# EAGLE design gesture_calculator (EAGLE 9.6.2)
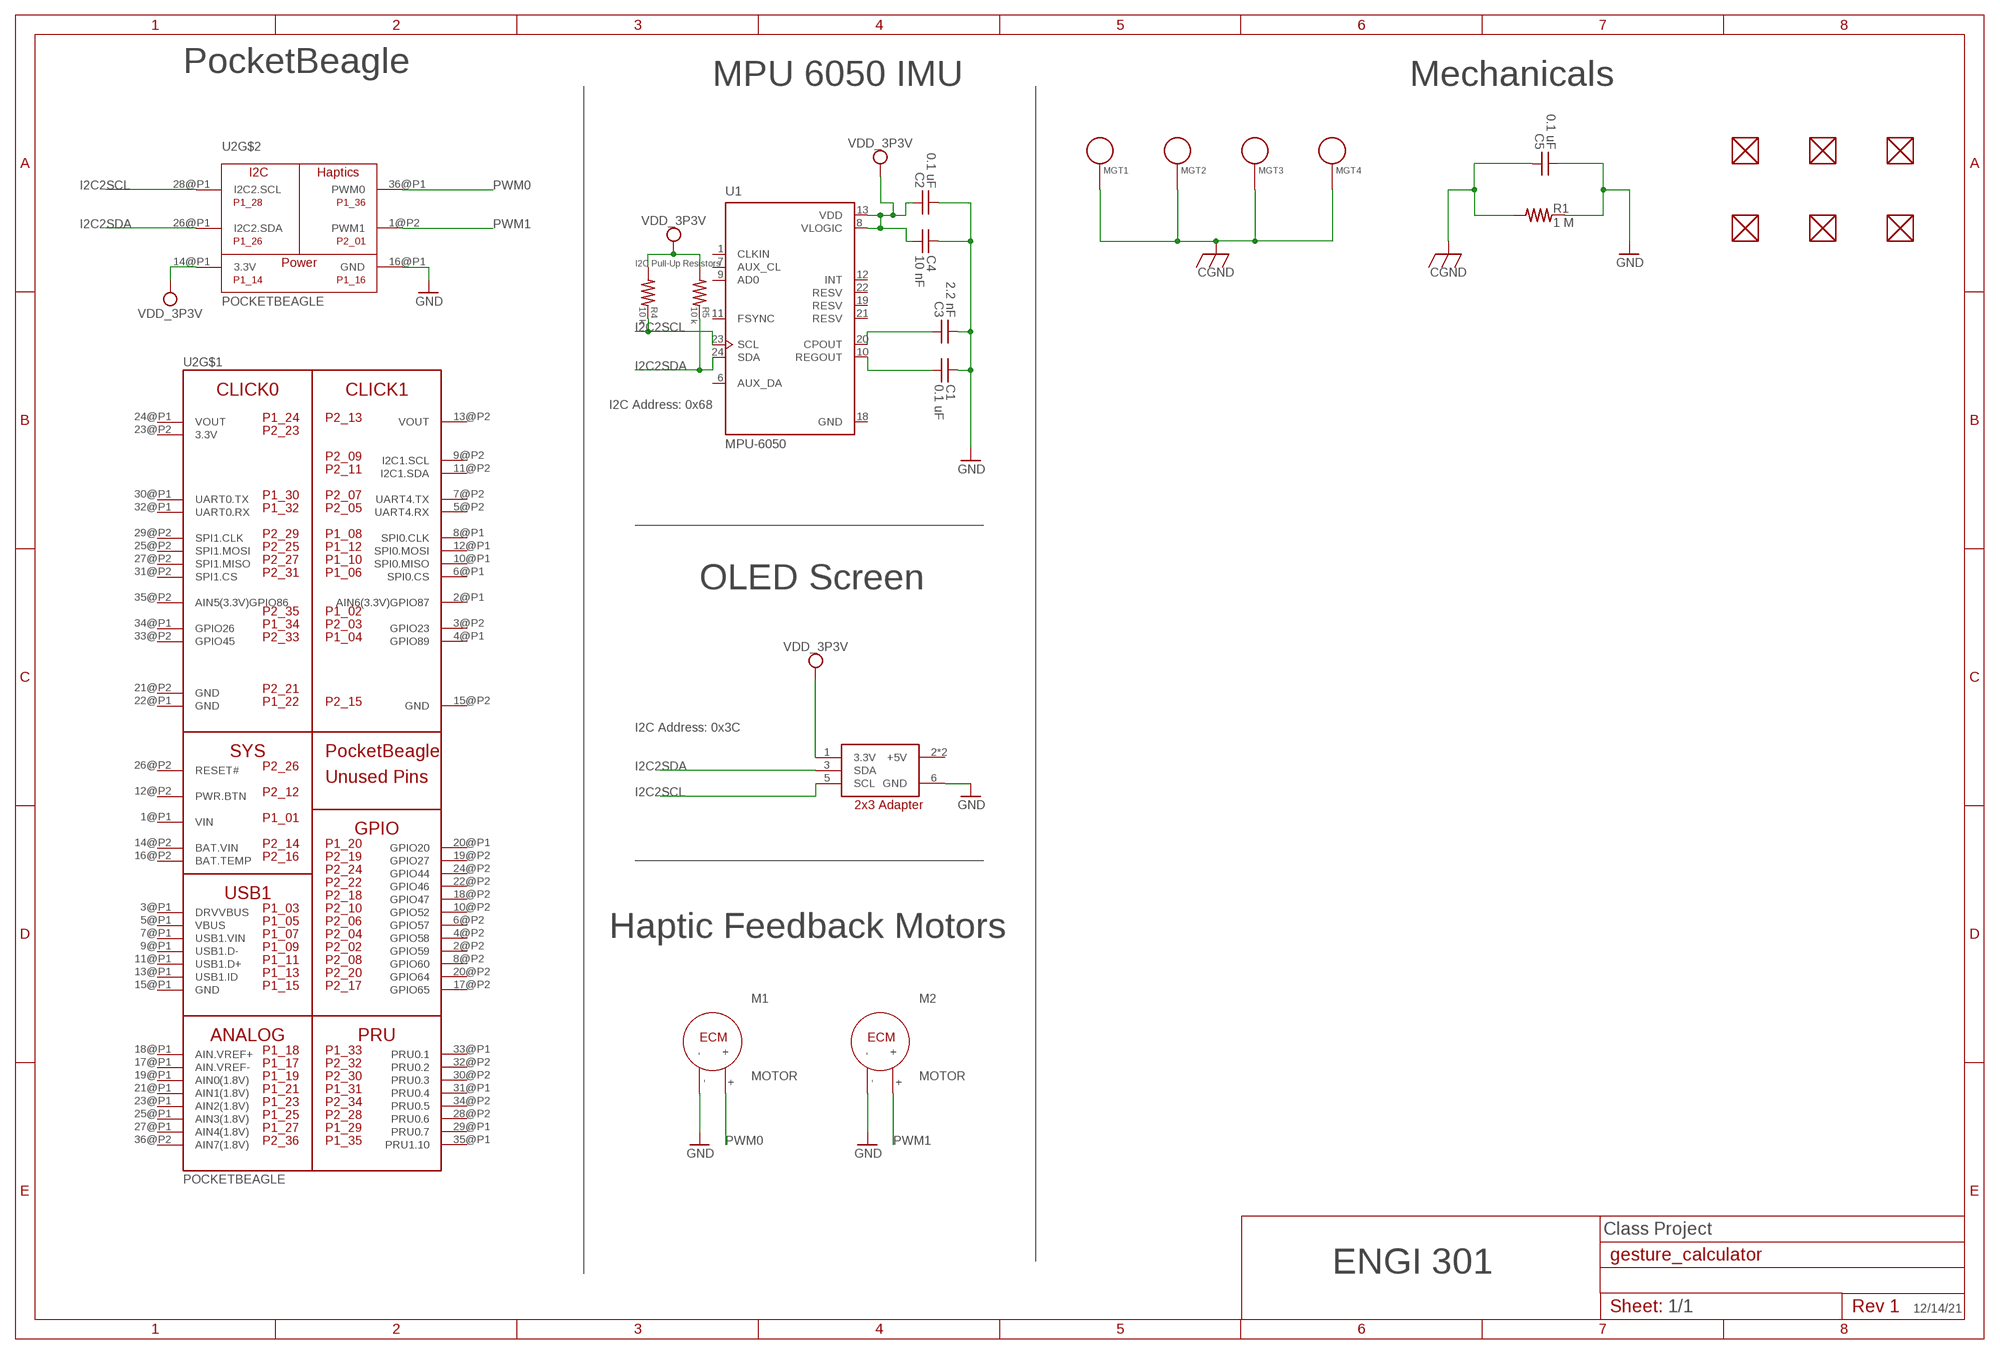
[diagram p0: schematic, sheet 1]

## Parts
C1  0.1 uF  CAPACITOR-(INCH)-0603  [0603]
C2  0.1 uF  CAPACITOR-(INCH)-0603  [0603]
C3  2.2 nF  CAPACITOR-(INCH)-0603  [0603]
C4  10 nF  CAPACITOR-(INCH)-0603  [0603]
C5  0.1 uF  CAPACITOR-(INCH)-0603  [0603]
FUD1  FIDUCIAL  [FIDUCIAL_40MIL]
FUD2  FIDUCIAL  [FIDUCIAL_40MIL]
FUD3  FIDUCIAL  [FIDUCIAL_40MIL]
FUD4  FIDUCIAL  [FIDUCIAL_40MIL]
FUD5  FIDUCIAL  [FIDUCIAL_40MIL]
FUD6  FIDUCIAL  [FIDUCIAL_40MIL]
M1  MOTOR  [MOTOR]
M2  MOTOR  [MOTOR]
MGT1  MOUNTING_HOLE  [MOUNTING_HOLE]
MGT2  MOUNTING_HOLE  [MOUNTING_HOLE]
MGT3  MOUNTING_HOLE  [MOUNTING_HOLE]
MGT4  MOUNTING_HOLE  [MOUNTING_HOLE]
R1  1 M  RESISTOR-(INCH)-0603  [0603]
R4  10 k  RESISTOR-(INCH)-0603  [0603]
R5  10 k  RESISTOR-(INCH)-0603  [0603]
RPI1  ADAPTER_2X3_THM  [RASPBERRYPI_2X3]
U1  MPU-6050  [QFN50P400X400X95-24N]
U2  POCKETBEAGLE  [POCKETBEAGLE]

## Nets
CGND: C5.1 MGT1.P$1 MGT2.P$1 MGT3.P$1 MGT4.P$1 R1.1
GND: C1.1 C2.2 C3.2 C4.1 C5.2 M1.- M2.- R1.2 RPI1.6(GND) U2.16@P1(GND)
I2C2SCL: R4.2 RPI1.5(SCL) U1.23(SCL) U2.28@P1(I2C2.SCL)
I2C2SDA: R5.2 RPI1.3(SDA) U1.24(SDA) U2.26@P1(I2C2.SDA)
N$1: C1.2 U1.10(REGOUT)
N$2: C3.1 U1.20(CPOUT)
PWM0: M1.+ U2.36@P1(PWM0)
PWM1: M2.+ U2.1@P2(PWM1)
VDD_3P3V: C2.1 C4.2 R4.1 R5.1 RPI1.1(3.3V) U1.8(VLOGIC) U1.13(VDD) U2.14@P1(3.3V)
Unconnected: FUD1.P$1 FUD2.P$1 FUD3.P$1 FUD4.P$1 FUD5.P$1 FUD6.P$1 RPI1.2(+5V) RPI1.4(+5V) U1.1(CLKIN) U1.6(AUX_DA) U1.7(AUX_CL) U1.9(AD0) U1.11(FSYNC) U1.12(INT) U1.19(RESV) U1.21(RESV) U1.22(RESV) U2.2@P1(AIN6(3.3V)GPIO87) U2.2@P2(GPIO59) U2.3@P1(DRVVBUS) U2.3@P2(GPIO23) U2.4@P1(GPIO89) U2.4@P2(GPIO58) U2.5@P1(VBUS) U2.5@P2(UART4.RX) U2.6@P1(SPI0.CS) U2.6@P2(GPIO57) U2.7@P1(USB1.VIN) U2.7@P2(UART4.TX) U2.8@P1(SPI0.CLK) U2.8@P2(GPIO60) U2.9@P1(USB1.D-) U2.9@P2(I2C1.SCL) U2.10@P1(SPI0.MISO) U2.10@P2(GPIO52) U2.11@P1(USB1.D+) U2.11@P2(I2C1.SDA) U2.12@P1(SPI0.MOSI) U2.12@P2(PWR.BTN) U2.13@P1(USB1.ID) U2.15@P1(GND) U2.16@P2(BAT.TEMP) U2.17@P1(AIN.VREF-) U2.17@P2(GPIO65) U2.18@P1(AIN.VREF+) U2.18@P2(GPIO47) U2.19@P1(AIN0(1.8V)) U2.19@P2(GPIO27) U2.20@P1(GPIO20) U2.20@P2(GPIO64) U2.21@P1(AIN1(1.8V)) U2.22@P2(GPIO46) U2.23@P1(AIN2(1.8V)) U2.24@P2(GPIO44) U2.25@P1(AIN3(1.8V)) U2.25@P2(SPI1.MOSI) U2.26@P2(RESET#) U2.27@P1(AIN4(1.8V)) U2.27@P2(SPI1.MISO) U2.28@P2(PRU0.6) U2.29@P1(PRU0.7) U2.29@P2(SPI1.CLK) U2.30@P1(UART0.TX) U2.30@P2(PRU0.3) U2.31@P1(PRU0.4) U2.31@P2(SPI1.CS) U2.32@P1(UART0.RX) U2.32@P2(PRU0.2) U2.33@P1(PRU0.1) U2.33@P2(GPIO45) U2.34@P1(GPIO26) U2.34@P2(PRU0.5) U2.35@P1(PRU1.10) U2.35@P2(AIN5(3.3V)GPIO86) U2.36@P2(AIN7(1.8V))

## Notes on the sheet
- PocketBeagle
- MPU 6050 IMU | Mechanicals
- I2C Pull-Up Resistors
- I2C Address: 0x68
- OLED Screen
- I2C Address: 0x3C
- Haptic Feedback Motors
- Class Project
- ENGI 301
- 1/1 | 12/14/21

## Power pins joined to a net without a drawn wire
3.3V: U2.23@P2(3.3V)
BAT.VIN: U2.14@P2(BAT.VIN)
GND: U1.18(GND) U2.15@P2(GND) U2.21@P2(GND) U2.22@P1(GND)
VIN: U2.1@P1(VIN)
VOUT: U2.13@P2(VOUT) U2.24@P1(VOUT)

## Library data of the parts
C1-C5 = gesture_calculator:CAPACITOR-(INCH)-: Basic SMD ceramic capacitors
FUD1-FUD6 = gesture_calculator:FIDUCIAL
M1 M2 = gesture_calculator:MOTOR
MGT1-MGT4 = gesture_calculator:MOUNTING_HOLE: Chassis Mounting Hole w/GND connection ability
R1 R4 R5 = gesture_calculator:RESISTOR-(INCH)-: Basic SMD Resistors
RPI1 = gesture_calculator:ADAPTER_2X3
U1 = gesture_calculator:MPU-6050: MPU-6050 Six-Axis (Gyro + Accelerometer) MEMS MotionTracking™ Devices Check prices <https://pricing.snapeda.com/parts/MPU-6050/TDK%20InvenSense/view-part?ref=eda>; AVAILABILITY: In Stock; DESCRIPTION: MPU-6050 series Accelerometer, Gyroscope, 3 Axis Sensor Evaluation Board; MF: TDK InvenSense; MP: MPU-6050; PACKAGE: QFN-24 InvenSense; PRICE: None; PURCHASE-URL: https://pricing.snapeda.com/search/part/MPU-6050/?ref=eda
U2 = gesture_calculator:POCKETBEAGLE

## Board
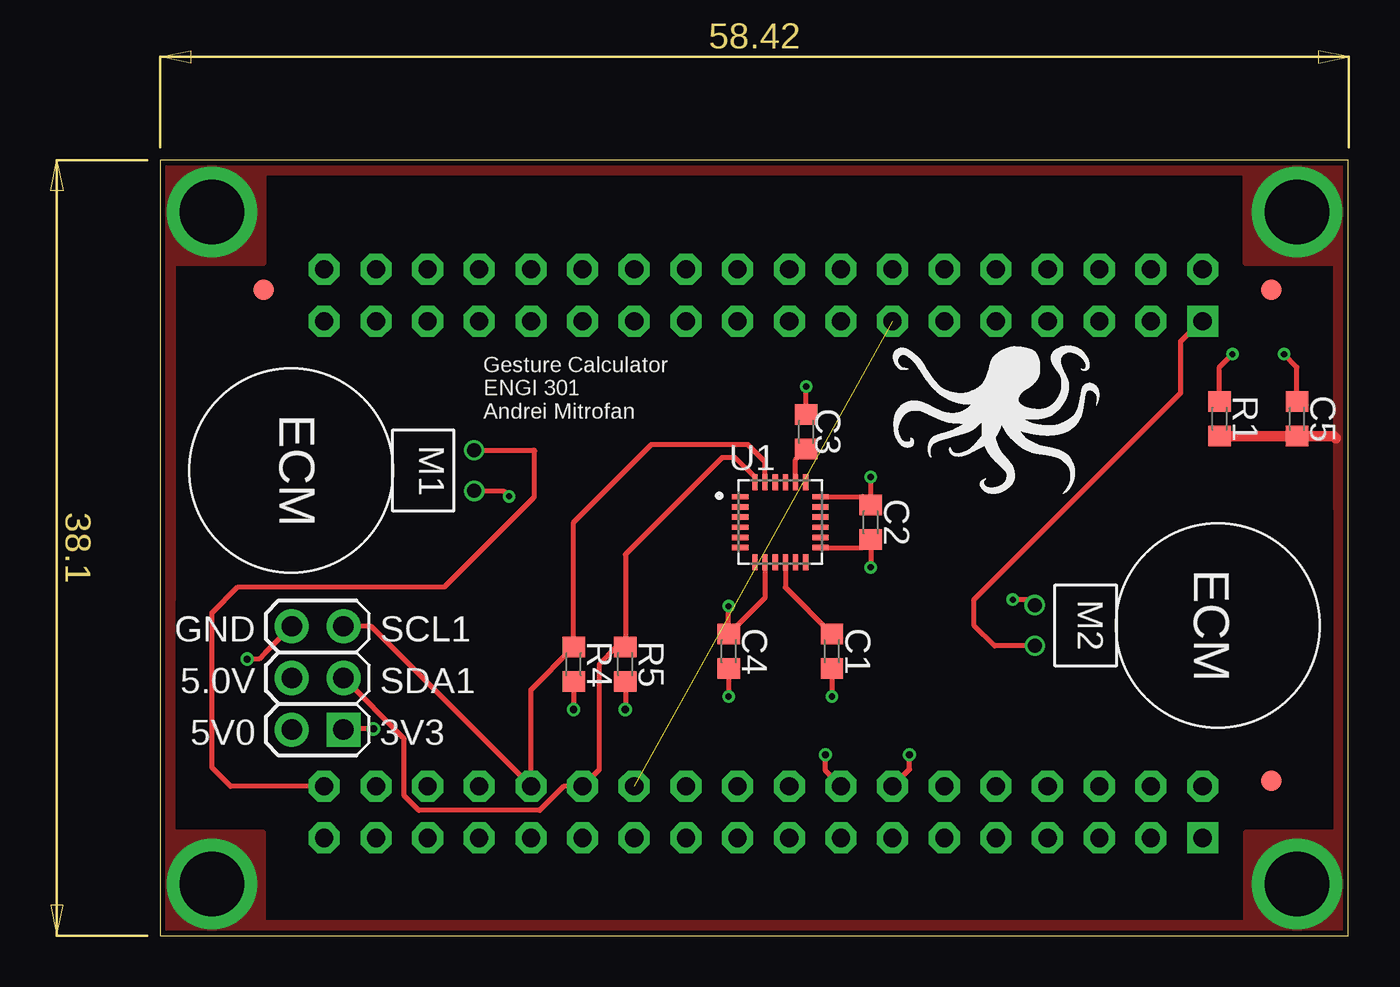
[diagram p1: board, top side]
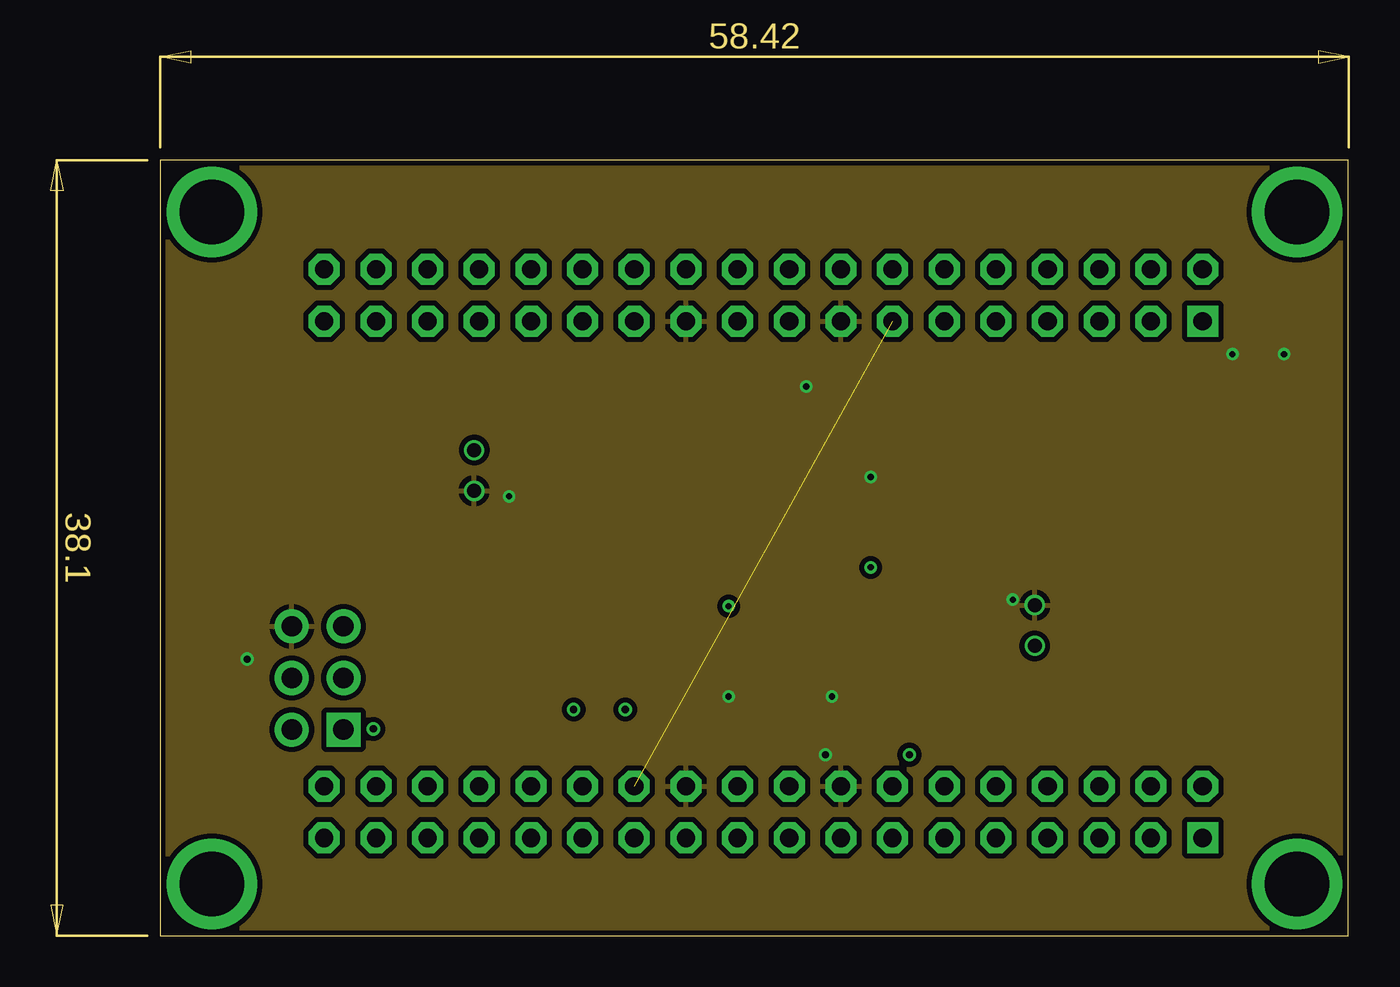
[diagram p2: board, inner layer Route2]
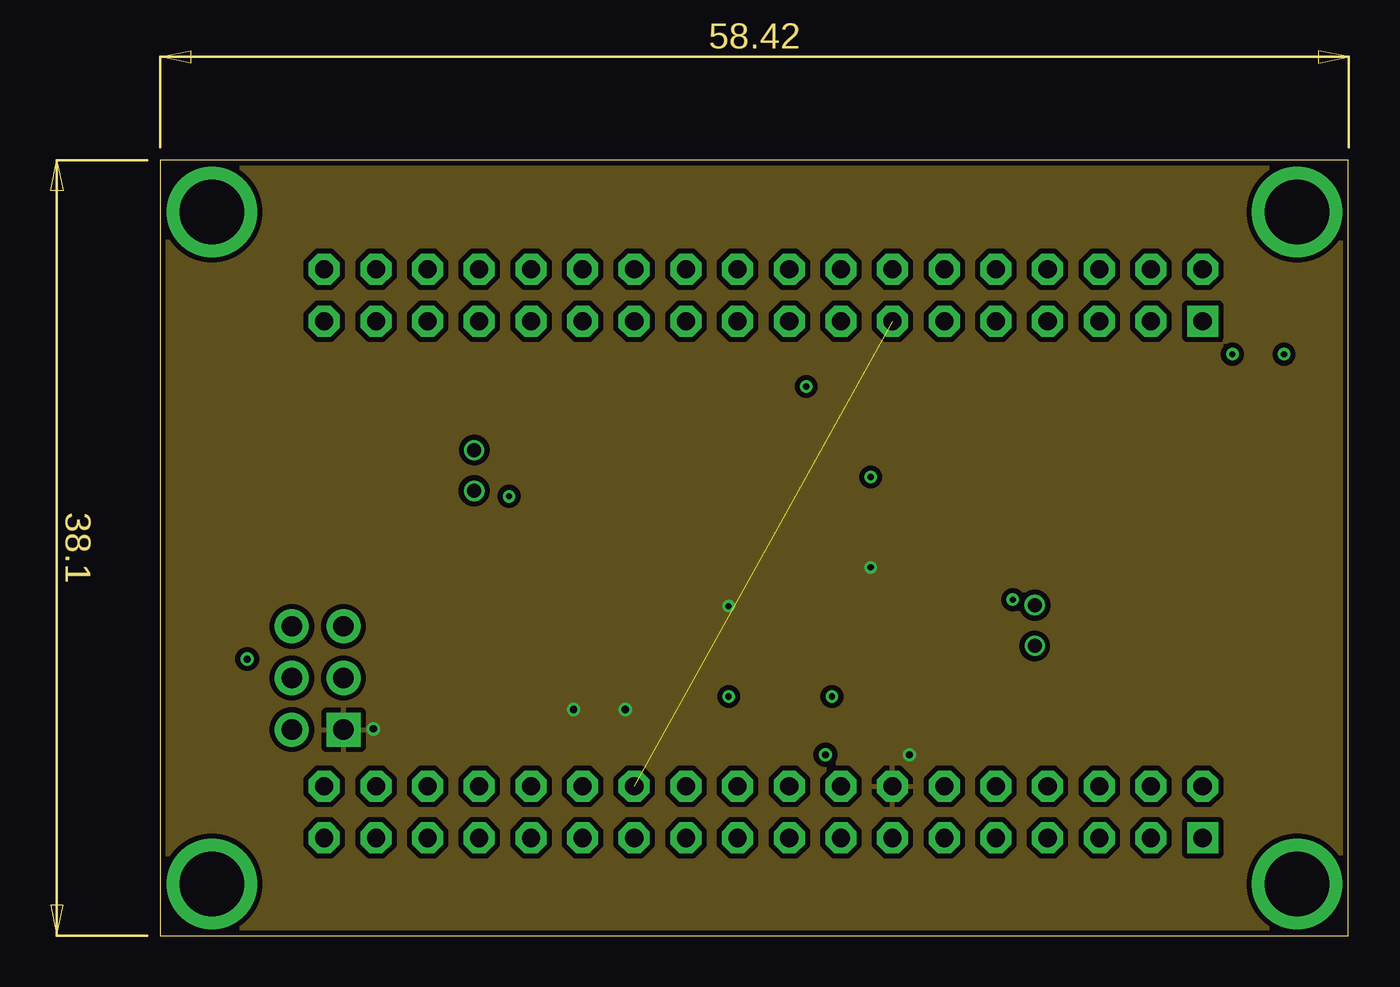
[diagram p3: board, inner layer Route15]
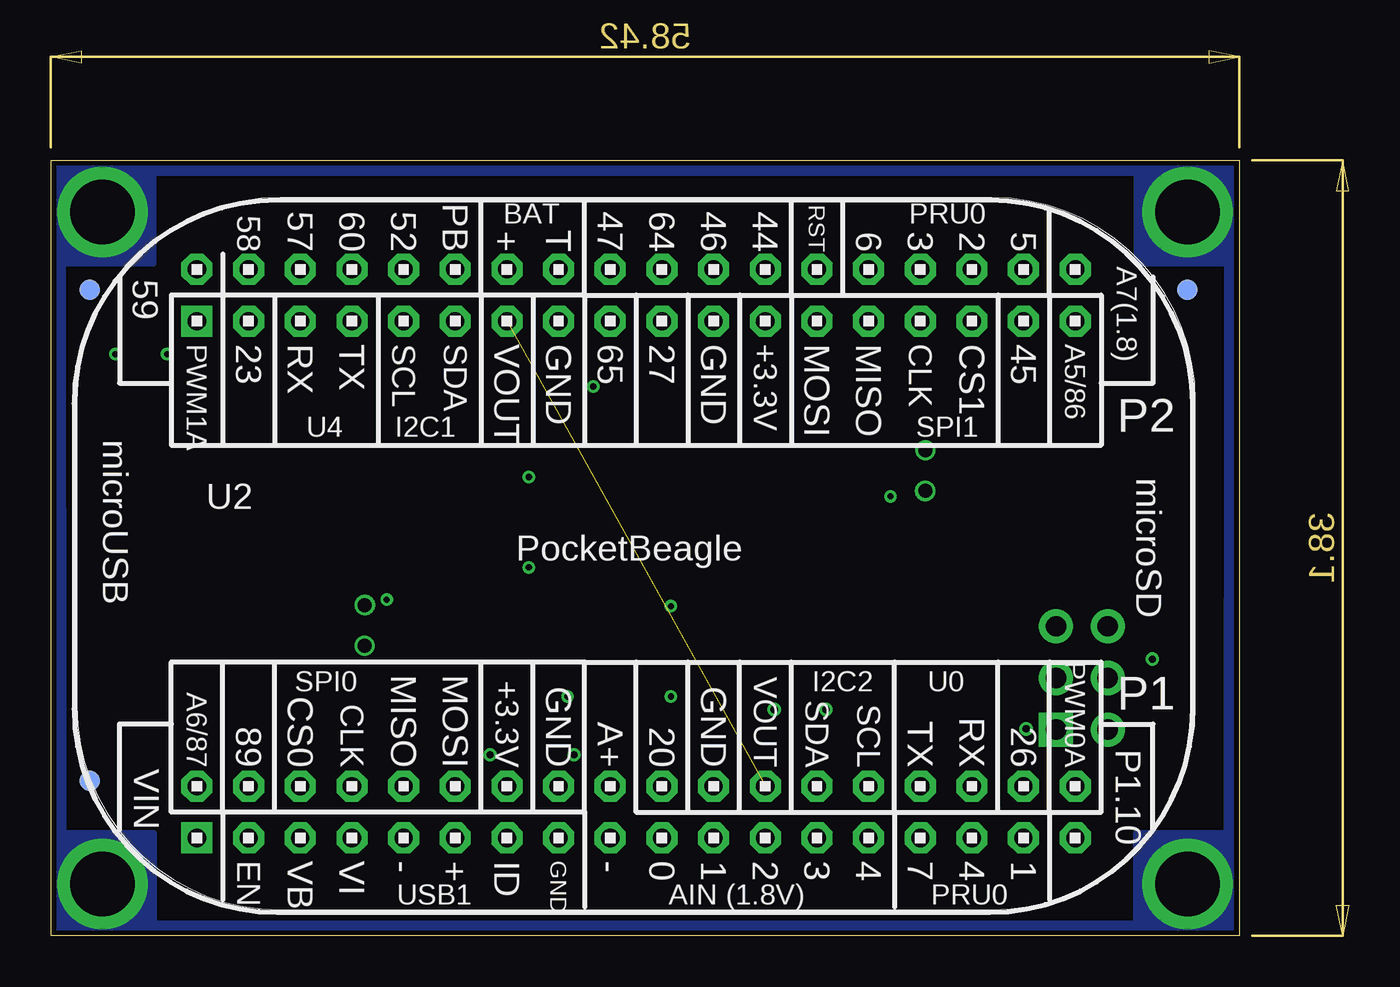
[diagram p4: board, bottom side, seen from below]

Size 58.4 x 38.1 mm. Coordinates in mm from the lower left corner, seen from the top.
Outline: 0,0 58.4,0 58.4,38.1 0,38.1 0,0
Copper layers (1*2*15*16): Top 0.035mm / dielectric 0.23mm / Route2 0.035mm / dielectric 0.93mm / Route15 0.035mm / dielectric 0.23mm / Bottom 0.035mm
Design rules "ENGI301_4lyr": minimum track width 10mil, minimum drill 12mil, track to track 10mil, track to pad 10mil, pad to pad 10mil, via to via 10mil, smd to smd 10mil, copper to edge 10mil, drill to drill 12mil, minimum pad ring 6mil, minimum via ring 6mil, stop-mask expansion 3mil, vias tented up to drill 25mil, thermal gap 10mil

### Footprints (pad centres in the part's own frame; a part is rotated, then mirrored left to right if it is on the bottom)
0603 = smd 1 x 1.1: 1 -0.85,0; 2 0.85,0
FIDUCIAL_40MIL = smd 1.016 x 1.016: P$1 0,0
MOTOR = drill 0.686: + 1,-4 | drill 0.7: - -1,-4
MOUNTING_HOLE = drill 3.175 pad 4.445: P$1 0,0
RASPBERRYPI_2X3 = drill 1 pad 1.676 square: 1 -1.27,2.54 | drill 1 pad 1.676: 2 1.27,2.54; 3 -1.27,0; 4 1.27,0; 5 -1.27,-2.54; 6 1.27,-2.54
QFN50P400X400X95-24N = smd 0.79 x 0.26: 1 -1.97,1.25; 2 -1.97,0.75; 3 -1.97,0.25; 4 -1.97,-0.25; 5 -1.97,-0.75; 6 -1.97,-1.25; 13 1.97,-1.25; 14 1.97,-0.75; 15 1.97,-0.25; 16 1.97,0.25; 17 1.97,0.75; 18 1.97,1.25 | smd 0.26 x 0.79: 7 -1.25,-1.97; 8 -0.75,-1.97; 9 -0.25,-1.97; 10 0.25,-1.97; 11 0.75,-1.97; 12 1.25,-1.97; 19 1.25,1.97; 20 0.75,1.97; 21 0.25,1.97; 22 -0.25,1.97; 23 -0.75,1.97; 24 -1.25,1.97
POCKETBEAGLE = drill 0.889 pad 1.524 square: 1@P1 5.91,3.53; 1@P2 5.91,28.93 | drill 0.889 pad 1.524 octagon: 2@P1 5.91,6.07; 2@P2 5.91,31.47; 3@P1 8.45,3.53; 3@P2 8.45,28.93; 4@P1 8.45,6.07; 4@P2 8.45,31.47; 5@P1 10.99,3.53; 5@P2 10.99,28.93; 6@P1 10.99,6.07; 6@P2 10.99,31.47; 7@P1 13.53,3.53; 7@P2 13.53,28.93; 8@P1 13.53,6.07; 8@P2 13.53,31.47; 9@P1 16.07,3.53; 9@P2 16.07,28.93; 10@P1 16.07,6.07; 10@P2 16.07,31.47; 11@P1 18.61,3.53; 11@P2 18.61,28.93; 12@P1 18.61,6.07; 12@P2 18.61,31.47; 13@P1 21.15,3.53; 13@P2 21.15,28.93; 14@P1 21.15,6.07; 14@P2 21.15,31.47; 15@P1 23.69,3.53; 15@P2 23.69,28.93; 16@P1 23.69,6.07; 16@P2 23.69,31.47; 17@P1 26.23,3.53; 17@P2 26.23,28.93; 18@P1 26.23,6.07; 18@P2 26.23,31.47; 19@P1 28.77,3.53; 19@P2 28.77,28.93; 20@P1 28.77,6.07; 20@P2 28.77,31.47; 21@P1 31.31,3.53; 21@P2 31.31,28.93; 22@P1 31.31,6.07; 22@P2 31.31,31.47; 23@P1 33.85,3.53; 23@P2 33.85,28.93; 24@P1 33.85,6.07; 24@P2 33.85,31.47; 25@P1 36.39,3.53; 25@P2 36.39,28.93; 26@P1 36.39,6.07; 26@P2 36.39,31.47; 27@P1 38.93,3.53; 27@P2 38.93,28.93; 28@P1 38.93,6.07; 28@P2 38.93,31.47; 29@P1 41.47,3.53; 29@P2 41.47,28.93; 30@P1 41.47,6.07; 30@P2 41.47,31.47; 31@P1 44.01,3.53; 31@P2 44.01,28.93; 32@P1 44.01,6.07; 32@P2 44.01,31.47; 33@P1 46.55,3.53; 33@P2 46.55,28.93; 34@P1 46.55,6.07; 34@P2 46.55,31.47; 35@P1 49.09,3.53; 35@P2 49.09,28.93; 36@P1 49.09,6.07; 36@P2 49.09,31.47

### Placement (x,y rotation side)
C1  33.02,13.97 90 top
C2  34.93,20.32 90 top
C3  31.75,24.77 90 top
C4  27.94,13.97 90 top
C5  55.88,25.4 90 top
FUD1  54.61,7.62 0 top
FUD2  2.54,31.75 0 bottom
FUD3  54.61,31.75 0 top
FUD4  5.08,31.75 0 top
FUD5  56.52,7.62 0 bottom
FUD6  56.52,31.75 0 bottom
M1  11.43,22.86 90 top
M2  46.99,15.24 270 top
MGT1  55.88,35.56 0 top
MGT2  2.54,35.56 0 top
MGT3  55.88,2.54 180 top
MGT4  2.54,2.54 0 top
R1  52.07,25.4 90 top
R4  20.32,13.34 90 top
R5  22.86,13.34 90 top
RPI1  7.73,12.66 180 top
U1  30.48,20.32 0 top
U2  57.15,1.27 0 bottom

### Tracks (layer width: path | path; a pad name or v marks a point on that pad's centre or on a via)
CGND
  Top 0.508: R1.1 C5.1 57.68,24.55 57.79,24.45
  pour Top (no thermals): 0.64,16.51 -0.63,16.51 -0.63,-0.64 59.06,-0.64 59.06,20.96 57.79,20.96 57.79,5.08 53.34,5.08 53.34,0.63 5.08,0.63 5.08,5.08 0.64,5.08
  pour Top (no thermals): 0.64,16.51 -0.63,16.51 -0.63,38.73 59.06,38.73 59.06,20.96 57.79,20.96 57.79,33.02 53.34,33.02 53.34,37.47 5.08,37.47 5.08,33.02 0.64,33.02
  pour Bottom (no thermals): 0.64,16.51 -0.63,16.51 -0.63,38.73 59.06,38.73 59.06,20.96 57.79,20.96 57.79,33.02 53.34,33.02 53.34,37.47 5.08,37.47 5.08,33.02 0.64,33.02
  pour Bottom (no thermals): -0.63,16.51 -0.63,-0.64 59.06,-0.64 59.06,20.96 57.79,20.96 57.79,5.08 53.34,5.08 53.34,0.63 5.08,0.63 5.08,5.08 0.64,5.08 0.64,16.51
GND  (via drill 0.3 pad 0.61, 0.35)
  Top 0.254: M2.- 42.72,16.51 v41.91,16.51 | R1.2 52.07,27.94 v52.71,28.57 | C5.2 55.88,27.94 v55.25,28.57 | C1.1 v33.02,11.75 | C4.1 v27.94,11.75 | v34.93,22.54 C2.2 34.53,21.57 U1.18 | C3.2 v31.75,26.99 | M1.- 16.88,21.86 v17.15,21.59 | U2.16@P1 32.7,8.1 v32.7,8.89 | 6.46,15.13 RPI1.6 5.16,13.89 4.85,13.59 v4.27,13.59
  pour Route2: -2.54,40.64 -2.54,-2.54 60.96,-2.54 60.96,40.64
I2C2SCL
  Top 0.254: U1.23 29.73,23.29 28.89,24.13 24.13,24.13 20.32,20.32 R4.2 18.22,12.09 U2.28@P1 10.36,15.2 RPI1.5
I2C2SDA
  Top 0.254: U1.24 29.23,22.52 28.26,23.5 27.62,23.5 22.86,18.73 R5.2 22.44,14.19 21.59,13.34 21.59,8.17 U2.26@P1 19.84,7.34 18.65,6.16 12.71,6.16 12,6.87 12,9.67 RPI1.3
N$1
  Top 0.254: U1.10 30.73,17.11 C1.2
N$2
  Top 0.254: U1.20 31.23,23.39 C3.1
PWM0
  Top 0.254: M1.+ 18.37,23.86 | 18.42,23.81 18.37,23.86 | 18.37,23.86 18.37,21.54 13.97,17.14 3.81,17.14 2.54,15.88 2.54,8.25 3.45,7.34 U2.36@P1
PWM1
  Top 0.254: M2.+ 41.01,14.24 40.01,15.24 40.01,16.51 50.17,26.67 50.17,29.21 51.16,30.2 U2.1@P2
VDD_3P3V  (via drill 0.3 pad 0.61, 0.35)
  Top 0.254: U1.8 29.73,16.61 C4.2 v27.94,16.19 | v34.93,18.1 C2.1 34.53,19.07 U1.13 | R4.1 v20.32,11.11 | R5.1 v22.86,11.11 | U2.14@P1 36.83,8.17 v36.83,8.89 | RPI1.1 9.04,10.16 v10.48,10.16
  pour Route15: -5.08,43.18 -5.08,-5.08 63.5,-5.08 63.5,43.18
VOUT  (1 unrouted)

### Text on the board
tPlace: Gesture Calculator / ENGI 301 / Andrei Mitrofan